# Altium project radxa_cm3_io_board_v1330.PrjPcb (part 4 of 4)
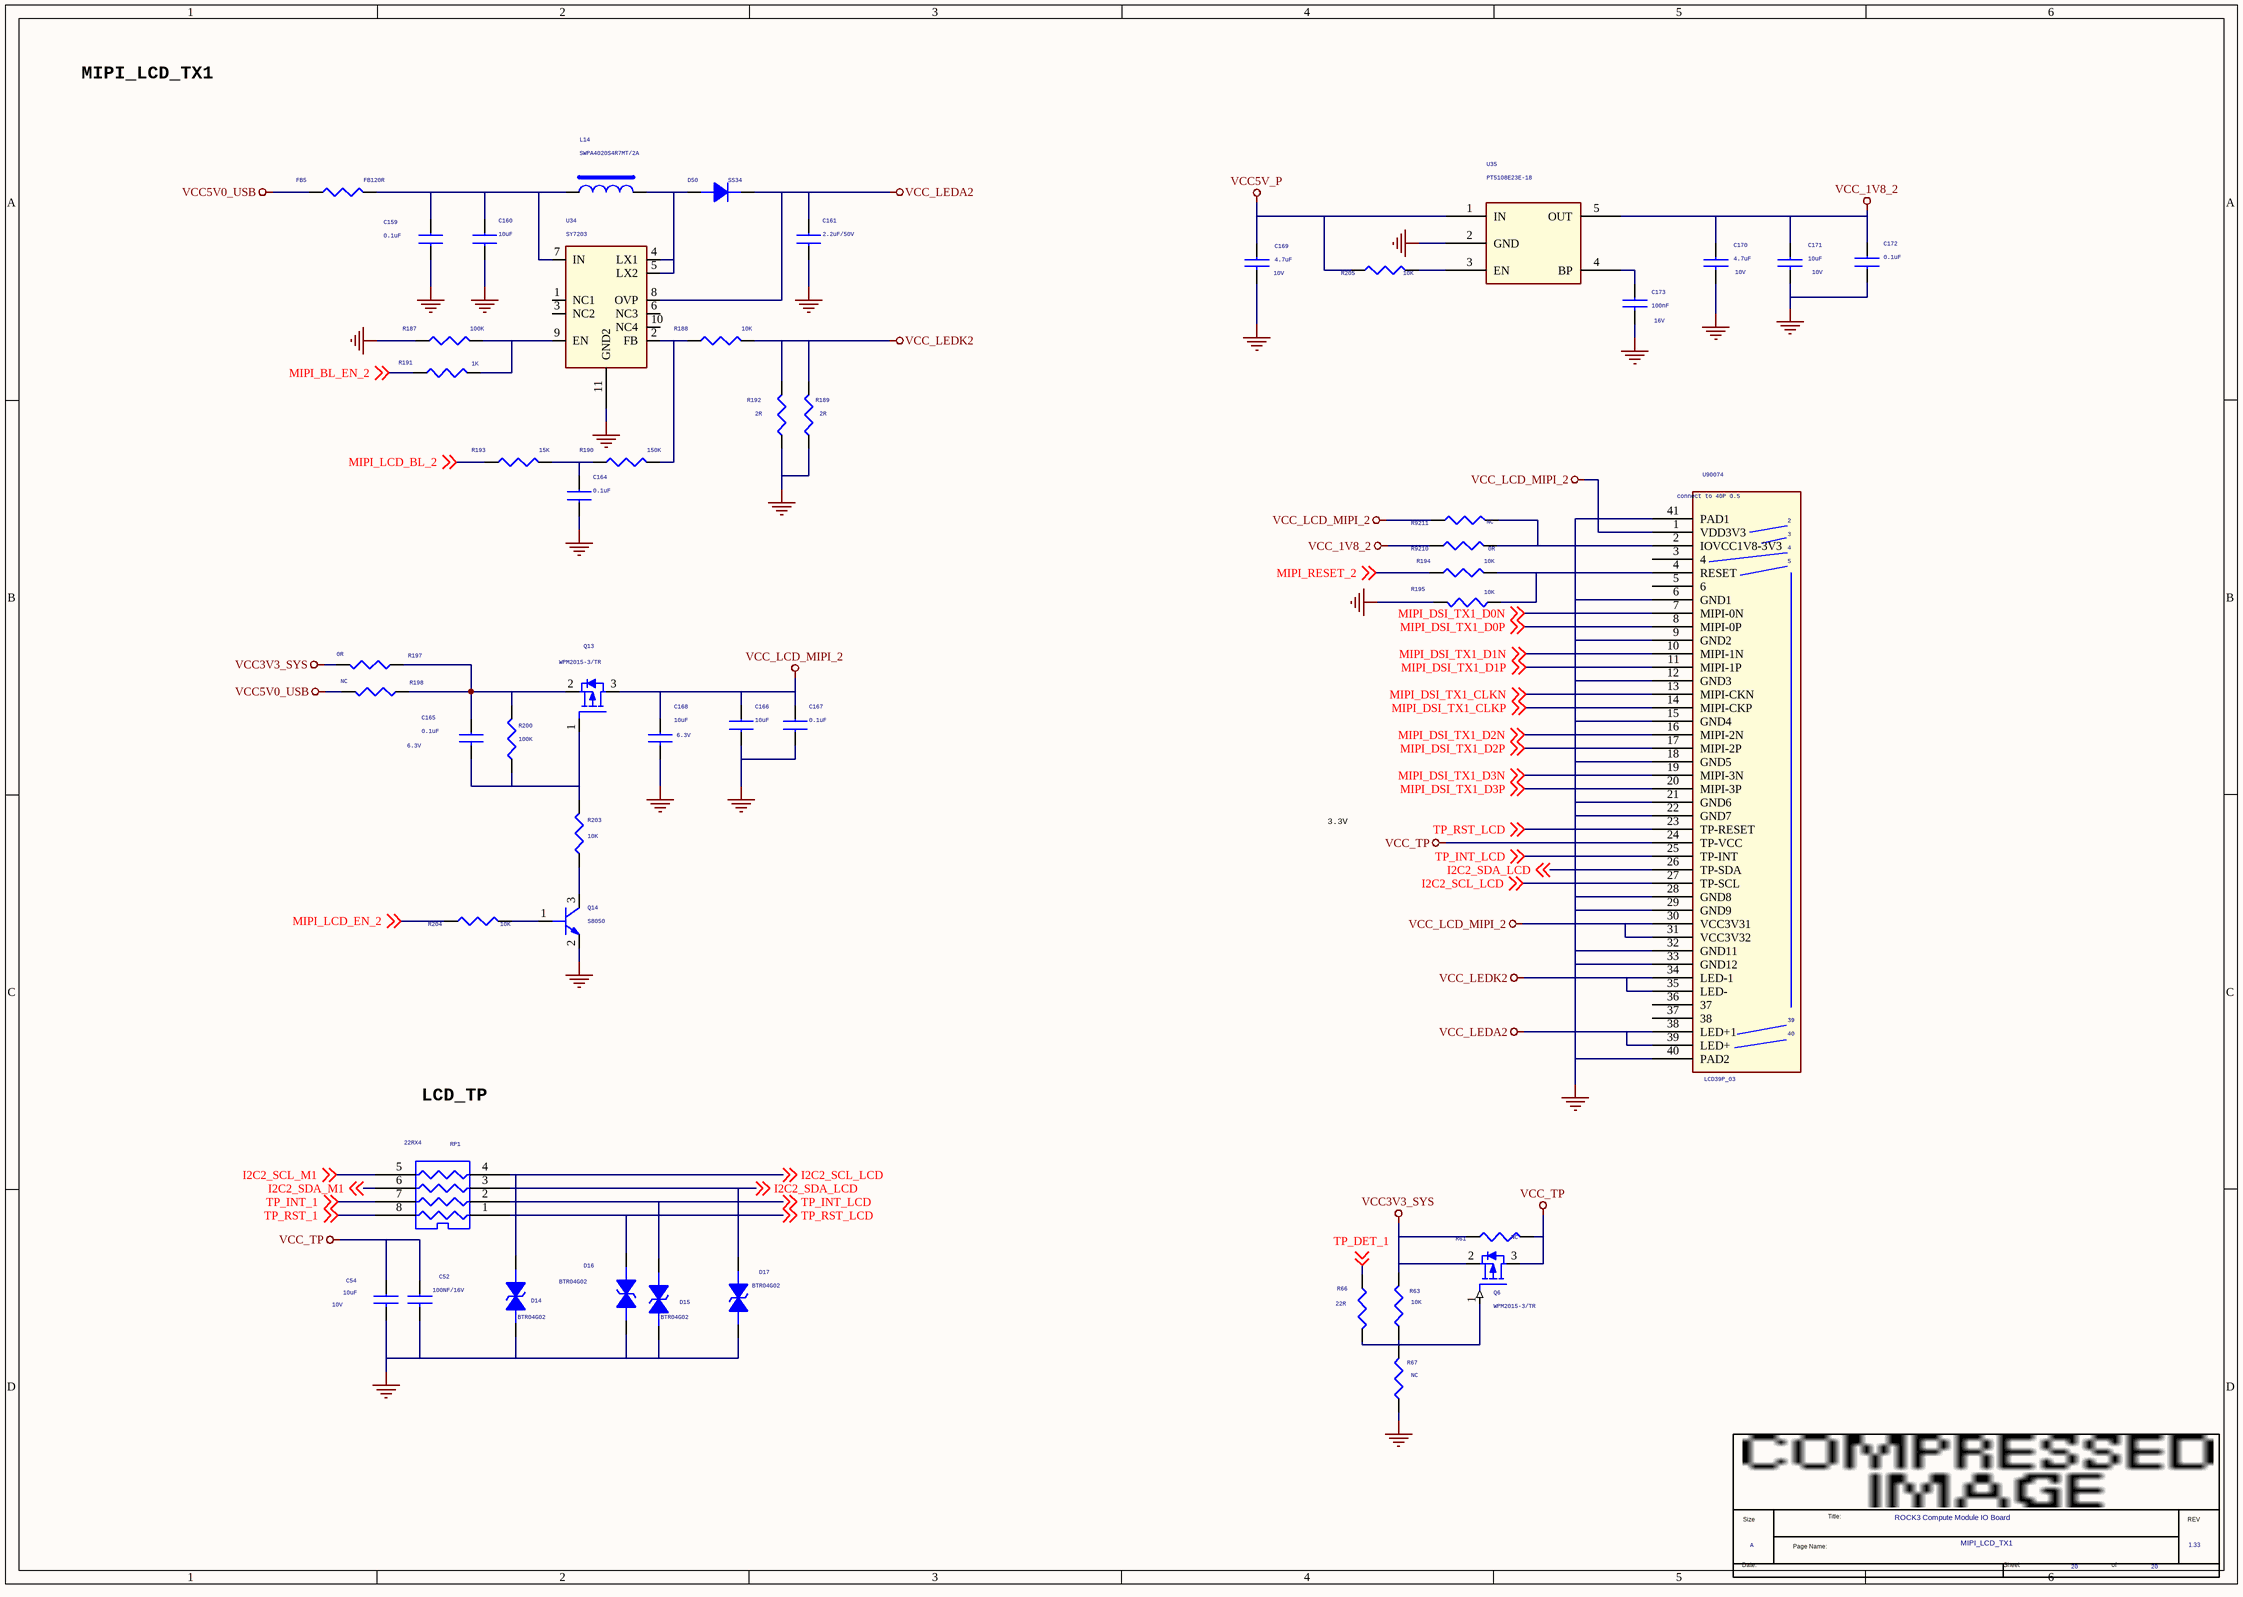
[diagram p118: 20.SchDoc]

## Nets that join several sheets
+1V8: 08 (C36.1 R34.2), 16 (R171.2), 17 (U33.88 U33.90)
+3V3: 16 (R170.2 R176.2), 17 (U33.84 U33.86)
+5V_INPUT: 04 (D1.1), 15 (9 pins), 17 (6 pins)
BAT_3V7_LOSE: 14 (BAT1.2 P3.1), 19 (J24.78 J24.80 J24.82)
BAT_3V7_PLUS: 14 (BAT1.1 D42.1 P1.1), 19 (J24.84 J24.86 J24.88)
GND: 04 (18 pins), 05 (11 pins), 06 (16 pins), 07 (41 pins), 08 (10 pins), 09 (38 pins), 10 (27 pins), 11 (41 pins), 12 (50 pins), 13 (36 pins), 14 (13 pins), 15 (45 pins), 16 (20 pins), 17 (21 pins), 18 (34 pins), 19 (29 pins), 20 (39 pins)
GPIO_VREF: 14 (Q15.1 Q16.1 R210.1 R212.1), 16 (7 pins), 17 (U33.78)
TS: 14 (BAT1.3 P2.1), 19 (J24.90)
VBUS: 12 (C86.1 J16.1 R100.2), 19 (R185.1)
VCC3V3_SYS: 05 (R4.2 R10.2), 06 (R9212.2), 07 (5 pins), 09 (5 pins), 10 (R62.1), 11 (FB2.1 FB3.1 FB4.1), 13 (5 pins), 14 (5 pins), 15 (8 pins), 16 (CON1.1 CON1.17 R169.2), 20 (Q6.2 R61.1 R63.2 R197.1)
VCC5V0_USB: 10 (FB1.1 R64.1), 12 (6 pins), 13 (C99.1 U20.5), 14 (R211.1 R217.1), 15 (7 pins), 16 (CON1.2 CON1.4), 19 (R223.1), 20 (FB5.1 R198.1)
VCC5V_P: 10 (C59.1 R70.1 U11.1), 12 (C85.1 L4.1), 15 (C157.1 C158.1 Q10.3 R162.1), 20 (C169.1 R205.1 U35.1)
VCC12V: 07 (11 pins), 09 (C38.1 Q2.2 R36.1 R37.1), 14 (C126.1 C127.1 U26.2), 15 (11 pins)
VCCIO_SD: 06 (5 pins), 19 (R184.1)
3V3_PWR_EN: 15 (R159.1), 19 (J24.74)
4G_DISABLE: 16 (CON1.26), 17 (U33.37)
5V_PWR_EN: 15 (R165.2 R166.1), 19 (J24.14)
AIN0: 16 (U30.5), 17 (U33.96)
AIN1: 16 (U30.6), 17 (U33.94)
BT_nDis: 16 (U31.3), 17 (U33.91)
CAM_GPIO: 11 (R73.2), 17 (U33.97)
CAM_PWR_2: 11 (R71.2), 19 (J24.12)
CAM_RESET_1: 11 (R72.2), 19 (J24.40)
EDP_TX_AUXN: 09 (C44.2), 19 (J24.41)
EDP_TX_AUXP: 09 (C43.1), 19 (J24.39)
EDP_TX_D0N: 09 (J11.12), 19 (J24.17)
EDP_TX_D0P: 09 (J11.13), 19 (J24.15)
EDP_TX_D1N: 09 (J11.9), 19 (J24.23)
EDP_TX_D1P: 09 (J11.10), 19 (J24.21)
EDP_TX_D2N: 09 (J11.6), 19 (J24.29)
EDP_TX_D2P: 09 (J11.7), 19 (J24.27)
EDP_TX_D3N: 09 (J11.3), 19 (J24.35)
EDP_TX_D3P: 09 (J11.4), 19 (J24.33)
EEPROM_nWP: 16 (U30.4), 17 (U33.20)
HDMI_TX0N_PORT: 04 (J1.9 U2.2 U2.9), 18 (U33.184)
HDMI_TX0P_PORT: 04 (J1.7 U2.1 U2.10), 18 (U33.182)
HDMI_TX1N_PORT: 04 (J1.6 U1.5 U1.6), 18 (U33.178)
HDMI_TX1P_PORT: 04 (J1.4 U1.4 U1.7), 18 (U33.176)
HDMI_TX2N_PORT: 04 (J1.3 U1.2 U1.9), 18 (U33.172)
HDMI_TX2P_PORT: 04 (J1.1 U1.1 U1.10), 18 (U33.170)
HDMI_TX_CEC_PORT: 04 (ED4.1 J1.13), 18 (U33.151)
HDMI_TX_HPD_PORT: 04 (ED1.1 J1.19), 18 (U33.153)
HDMI_TXCLKN_PORT: 04 (J1.12 U2.5 U2.6), 18 (U33.190)
HDMI_TXCLKP_PORT: 04 (J1.10 U2.4 U2.7), 18 (U33.188)
HDMI_TXDDC_SCL_PORT: 04 (ED3.1 J1.15), 18 (U33.200)
HDMI_TXDDC_SDA_PORT: 04 (ED2.1 J1.16), 18 (U33.199)
HP_DET_L_GPIO4_C4: 08 (R31.2), 19 (J24.70)
HP_SNS: 08 (R30.2), 19 (J24.52)
HPL_OUT: 08 (ED16.1 J8.3 TP2.1), 19 (J24.50)
HPR_OUT: 08 (ED18.1 J8.6 TP5.1), 19 (J24.54)
I2C0_SCL_PMIC: 11 (J14.5), 17 (U33.80)
I2C0_SDA_PMIC: 11 (J14.6), 17 (U33.82)
I2C2_SCL_M1: 11 (J15.5), 16 (CON1.28), 17 (U33.35), 20 (RP1.5)
I2C2_SCL_MO: 14 (R140.1), 16 (CON1.5), 17 (U33.56)
I2C2_SDA_M1: 11 (J15.6), 16 (CON1.27), 17 (U33.36), 20 (RP1.6)
I2C2_SDA_MO: 14 (R141.1), 16 (CON1.3), 17 (U33.58)
I2C3_SCL_TP: 09 (R49.1), 19 (J24.44)
I2C3_SDA_TP: 09 (R48.1), 19 (J24.46)
I2S1_LRCK_RX_M1: 11 (R80.2), 16 (CON1.36), 17 (U33.29)
I2S1_LRCK_TX_M1: 16 (CON1.35), 17 (U33.26)
I2S1_MCLK_M1: 07 (R28.2), 16 (CON1.22), 17 (U33.41)
I2S1_SCLK_TX_M1: 13 (R135.2), 16 (CON1.12), 17 (U33.49)
I2S1_SDI0_M1: 11 (R82.2), 16 (CON1.38), 17 (U33.27)
I2S1_SDI1_M1: 16 (CON1.18), 17 (U33.45)
I2S1_SDI2_M1: 16 (CON1.16), 17 (U33.47)
I2S1_SDI3_M1: 16 (CON1.7), 17 (U33.54)
I2S1_SDO0_M1: 16 (CON1.40), 17 (U33.25)
I2S1_SDO2_M1: 16 (CON1.29), 17 (U33.34)
LCD0_BL_EN: 09 (J11.32), 19 (J24.75)
LCD0_BL_PWM5: 09 (J11.33 R43.1), 19 (J24.95)
LCD1_PWREN_H: 09 (R41.1 U9.4), 19 (J24.4)
MIC1_IN: 08 (6 pins), 19 (J24.64)
MIC2_IN: 08 (J10.1), 19 (J24.66)
MIPI_BL_EN_1: 10 (R54.1), 19 (J24.85)
MIPI_BL_EN_2: 19 (J24.77), 20 (R191.1)
MIPI_CSI_RX_CLK0N: 11 (J14.20), 18 (U33.127)
MIPI_CSI_RX_CLK0P: 11 (J14.19), 18 (U33.129)
MIPI_CSI_RX_CLK1N: 11 (J15.20), 18 (U33.140)
MIPI_CSI_RX_CLK1P: 11 (J15.19), 18 (U33.142)
MIPI_CSI_RX_D0N: 11 (J14.14), 18 (U33.115)
MIPI_CSI_RX_D0P: 11 (J14.13), 18 (U33.117)
MIPI_CSI_RX_D1N: 11 (J14.17), 18 (U33.121)
MIPI_CSI_RX_D1P: 11 (J14.16), 18 (U33.123)
MIPI_CSI_RX_D2N: 11 (J15.14), 18 (U33.128)
MIPI_CSI_RX_D2P: 11 (J15.13), 18 (U33.130)
MIPI_CSI_RX_D3N: 11 (J15.17), 18 (U33.134)
MIPI_CSI_RX_D3P: 11 (J15.16), 18 (U33.136)
MIPI_DSI_TX0_CLKN/LVDS_TX0_CLKN: 10 (LCD1.18), 18 (U33.169)
MIPI_DSI_TX0_CLKP/LVDS_TX0_CLKP: 10 (LCD1.17), 18 (U33.171)
MIPI_DSI_TX0_D0N/LVDS_TX0_D0N: 10 (LCD1.21), 18 (U33.157)
MIPI_DSI_TX0_D0P/LVDS_TX0_D0P: 10 (LCD1.20), 18 (U33.159)
MIPI_DSI_TX0_D1N/LVDS_TX0_D1N: 10 (LCD1.15), 18 (U33.163)
MIPI_DSI_TX0_D1P/LVDS_TX0_D1P: 10 (LCD1.14), 18 (U33.165)
MIPI_DSI_TX0_D2N/LVDS_TX0_D2N: 10 (LCD1.12), 19 (J24.3)
MIPI_DSI_TX0_D2P/LVDS_TX0_D2P: 10 (LCD1.11), 19 (J24.5)
MIPI_DSI_TX0_D3N/LVDS_TX0_D3N: 10 (LCD1.24), 19 (J24.9)
MIPI_DSI_TX0_D3P/LVDS_TX0_D3P: 10 (LCD1.23), 19 (J24.11)
MIPI_DSI_TX1_CLKN: 18 (U33.187), 20 (U90074.13)
MIPI_DSI_TX1_CLKP: 18 (U33.189), 20 (U90074.14)
MIPI_DSI_TX1_D0N: 18 (U33.175), 20 (U90074.7)
MIPI_DSI_TX1_D0P: 18 (U33.177), 20 (U90074.8)
MIPI_DSI_TX1_D1N: 18 (U33.181), 20 (U90074.10)
MIPI_DSI_TX1_D1P: 18 (U33.183), 20 (U90074.11)
MIPI_DSI_TX1_D2N: 18 (U33.193), 20 (U90074.16)
MIPI_DSI_TX1_D2P: 18 (U33.195), 20 (U90074.17)
MIPI_DSI_TX1_D3N: 18 (U33.194), 20 (U90074.19)
MIPI_DSI_TX1_D3P: 18 (U33.196), 20 (U90074.20)
MIPI_LCD_BL_1: 10 (R57.1), 19 (J24.36)
MIPI_LCD_BL_2: 19 (J24.93), 20 (R193.1)
MIPI_LCD_EN_1: 10 (R69.1), 19 (J24.18)
MIPI_LCD_EN_2: 19 (J24.20), 20 (R204.1)
MIPI_RESET_1: 10 (R59.2), 19 (J24.83)
MIPI_RESET_2: 19 (J24.79), 20 (R194.1)
nPWR_LED: 16 (R178.1 R179.2), 17 (U33.95)
nRPIBOOT: 16 (U30.2), 17 (U33.93)
PCIE20_CLKREQn_M2: 07 (J6.B12), 18 (U33.102)
PCIE20_REFCLKN: 07 (J6.A14), 18 (U33.112)
PCIE20_REFCLKP: 07 (J6.A13), 18 (U33.110)
PCIE20_RXN: 07 (U8.7), 18 (U33.118)
PCIE20_RXP: 07 (U8.6), 18 (U33.116)
PCIE20_TXN: 07 (U8.3), 18 (U33.124)
PCIE20_TXP: 07 (U8.2), 18 (U33.122)
PCIE20_WAKEn: 07 (J6.B11), 19 (J24.38)
Pcie_nRST: 07 (J6.A11), 18 (U33.109)
PHY1_LED0_Y1: 05 (R6.1), 17 (U33.19)
PHY1_LED1_G: 05 (D3.2 R2.2 R3.1), 17 (U33.17)
PHY1_LED2_Y: 05 (R5.1), 17 (U33.15)
PHY1_MDI0+: 05 (J3.1 U5.1 U5.10), 17 (U33.12)
PHY1_MDI0-: 05 (J3.2 U5.2 U5.9), 17 (U33.10)
PHY1_MDI1+: 05 (J3.3 U5.4 U5.7), 17 (U33.4)
PHY1_MDI1-: 05 (J3.6 U5.5 U5.6), 17 (U33.6)
PHY1_MDI2+: 05 (J3.7 U6.1 U6.10), 17 (U33.11)
PHY1_MDI2-: 05 (J3.8 U6.2 U6.9), 17 (U33.9)
PHY1_MDI3+: 05 (J3.9 U6.4 U6.7), 17 (U33.3)
PHY1_MDI3-: 05 (J3.10 U6.5 U6.6), 17 (U33.5)
PI_nLED_Activity: 16 (R183.2), 17 (U33.21)
PMIC_RESET_KEY: 14 (R142.1), 17 (U33.100)
PMW0_M0: 16 (CON1.13), 17 (U33.48)
PMW0_M1: 14 (R214.2), 16 (CON1.11), 17 (U33.50)
PMW4: 16 (CON1.15), 17 (U33.46)
PWM3_IR: 14 (R215.2), 16 (CON1.37), 17 (U33.24)
PWM11: 16 (CON1.32), 17 (U33.31)
PWRON_KEY: 14 (R143.1), 16 (U30.14 U32.1), 17 (U33.99)
RUN_PG: 16 (R172.2 U32.3), 17 (U33.92)
SARADC_VIN0_KEY/RECOVERY: 14 (J22.2), 19 (J24.26)
SARADC_VIN1_HW_ID: 15 (R153.1), 19 (J24.28)
SARADC_VIN2_HP_HOOK: 08 (C35.1 R32.1 R33.2), 19 (J24.30)
SDMMC0_CLK: 06 (R11.1), 17 (U33.57)
SDMMC0_CMD: 06 (CN14A1.3 ED13.1), 17 (U33.62)
SDMMC0_D0: 06 (CN14A1.7 ED11.1), 17 (U33.63)
SDMMC0_D1: 06 (CN14A1.8 ED10.1), 17 (U33.67)
SDMMC0_D2/ARMJTAG_TCK: 06 (CN14A1.1 ED15.1), 17 (U33.69)
SDMMC0_D3/ARMJTAG_TMS: 06 (CN14A1.2 ED14.1), 17 (U33.61)
SDMMC0_DET_L: 06 (CN14A1.9 ED9.1), 17 (U33.76)
SDMMC_PWREN: 06 (R13.2), 17 (U33.75)
SPI0_CSO_MO: 16 (CON1.33), 17 (U33.28)
SPI0_MISO_MO: 16 (CON1.31), 17 (U33.30)
SPI3_CLK_M0: 16 (CON1.23), 17 (U33.38)
SPI3_CSO_M0: 16 (CON1.24), 17 (U33.39)
SPI3_MISO_M0: 11 (R79.2), 16 (CON1.21), 17 (U33.40)
SPI3_MOSI_M0: 16 (CON1.19), 17 (U33.44)
SPKN_OUT: 08 (J9.2), 19 (J24.58)
SPKP_OUT: 08 (J9.1), 19 (J24.60)
SYNC_IN: 16 (U30.8), 17 (U33.16)
SYNC_OUT: 16 (U30.9), 17 (U33.18)
TP_DET_1: 19 (J24.81), 20 (R66.1)
TP_INT_1: 19 (J24.87), 20 (RP1.7)
TP_INT_L: 09 (R46.1), 19 (J24.8)
TP_PWR_DET: 09 (R51.2), 19 (J24.24)
TP_RST_1: 19 (J24.89), 20 (RP1.8)
TP_RST_L: 09 (R45.1), 19 (J24.6)
TV_OUT: 16 (U30.11), 18 (U33.111)
UART2_RX: 16 (R168.2), 17 (U33.51)
UART2_TX: 16 (R167.2), 17 (U33.55)
USB2.0_HUB_PWR: 12 (R107.2 R108.1), 19 (J24.34)
USB2_HOST2_DM: 12 (U17.14), 19 (J24.65)
USB2_HOST2_DP: 12 (U17.15), 19 (J24.63)
USB2_HOST3_DM: 13 (L10.4 R126.1), 19 (J24.71)
USB2_HOST3_DP: 13 (L10.2 R124.1), 19 (J24.69)
USB3_HOST1_DM: 13 (L11.1 R128.2), 19 (J24.47)
USB3_HOST1_DP: 13 (L11.3 R129.2), 19 (J24.45)
USB3_HOST1_SSRXN: 13 (U22.7), 19 (J24.59)
USB3_HOST1_SSRXP: 13 (U22.6), 19 (J24.57)
USB3_HOST1_SSTXN: 13 (U22.3), 19 (J24.53)
USB3_HOST1_SSTXP: 13 (U22.2), 19 (J24.51)
USB_OTG0_DM: 12 (D19.2 L15.1 R92.2), 18 (U33.103)
USB_OTG0_DP: 12 (D18.2 L15.3 R93.2), 18 (U33.105)
USB_OTG0_ID: 12 (R95.2 R99.2), 18 (U33.101)
USB_OTG0_VBUSDET: 12 (R98.2), 19 (J24.97)
USB_PWR_H: 13 (U20.4), 19 (J24.10)
WL_nDis: 16 (U31.1), 17 (U33.89)